# Altium project sara-n210_breakout.PrjPcb
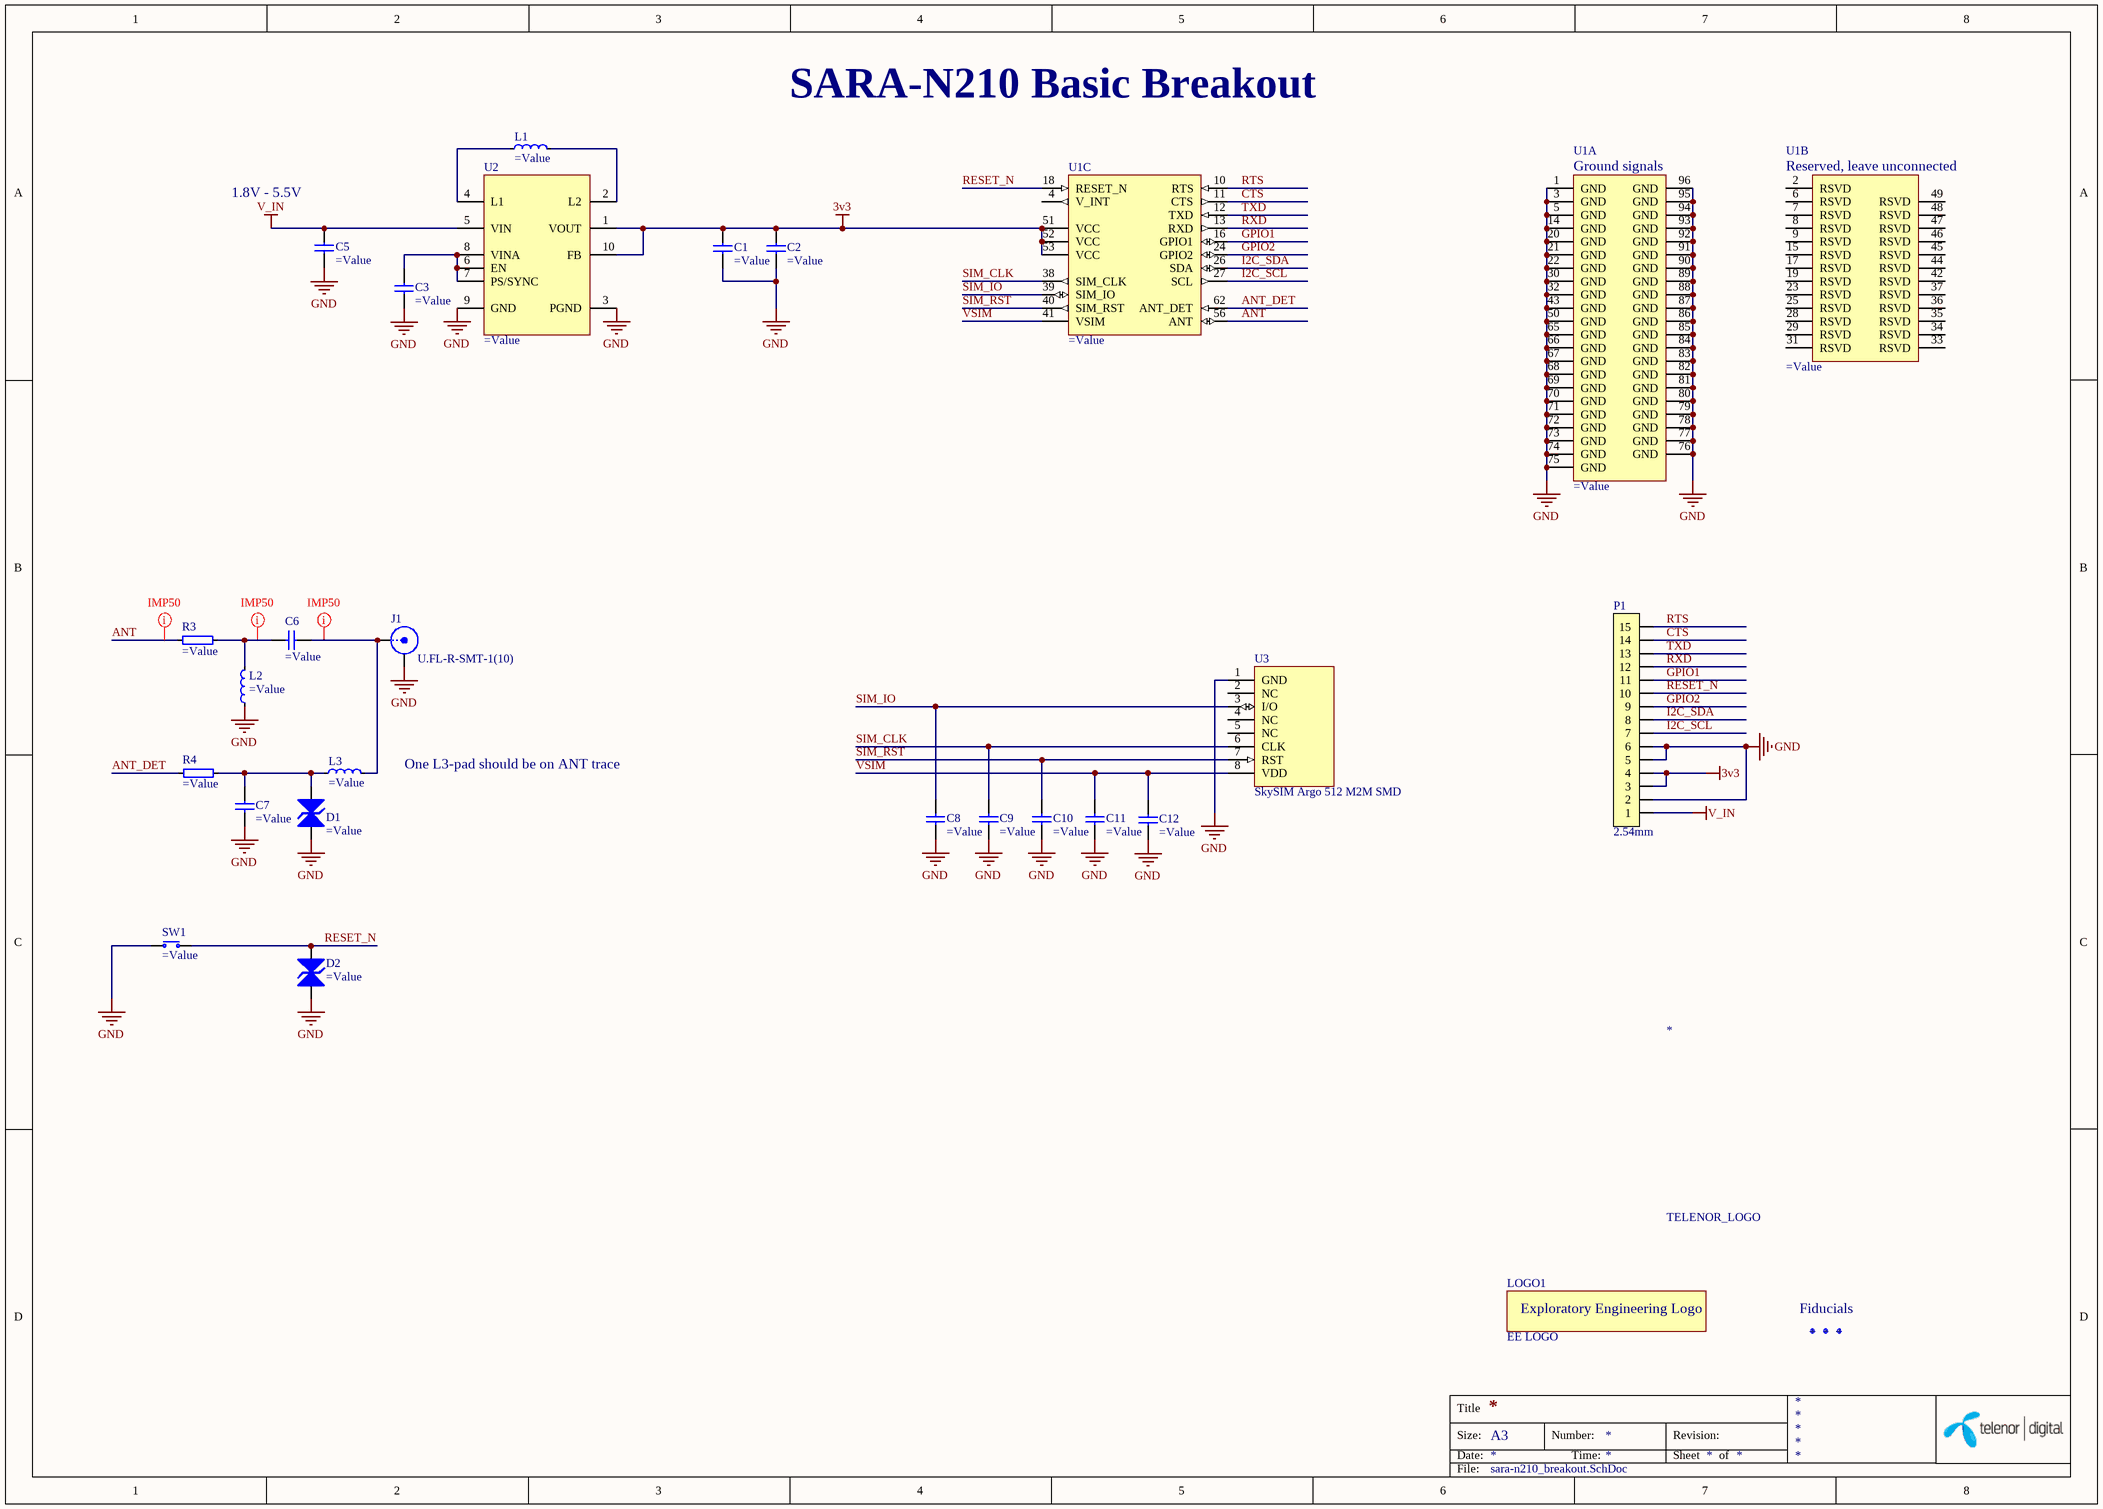
[diagram p0: sara-n210_breakout.SchDoc]
1 sheet, 29 parts. Net scope: global (net labels, ports and power ports of the same name join across sheets).
Board files: sara-n210_breakout.PcbDoc, panelized_sara-n210.PcbDoc

## Sheet sara-n210_breakout.SchDoc
size A3

### Parts
*  TELENOR_LOGO  [TELENOR_4mmx3.8mm]
C1  (no value)  [CAPC1005X04L]
C2  (no value)  [CAPC1005X04L]
C3  (no value)  [CAPC1005X04L]
C5  (no value)  [CAPC1005X04L]
C6  (no value)  [CAPC1005X04L]
C7  (no value)  [CAPC1005X04L]
C8  (no value)  [CAPC1005X04L]
C9  (no value)  [CAPC1005X04L]
C10  (no value)  [CAPC1005X04L]
C11  (no value)  [CAPC1005X04L]
C12  (no value)  [CAPC1005X04L]
D1  (no value)  [RESC1005X04L]
D2  (no value)  [RESC1005X04L]
Fid1  Fiducial mark  [Fiducial]  (value not drawn)
Fid2  Fiducial mark  [Fiducial]  (value not drawn)
Fid3  Fiducial mark  [Fiducial]  (value not drawn)
J1  U.FL-R-SMT-1(10)  [COAXIAL-UFL]
L1  (no value)  [INDP3030X11L]
L2  (no value)  [INDC1005X04L]
L3  (no value)  [INDC1005X04L]
LOGO1  EE LOGO  [EE_LOGO]
P1  2.54mm  [HDR_1x15_2.54mm_THRU]
R3  (no value)  [RESC1005X04L]
R4  (no value)  [RESC1005X04L]
SW1  (no value)  [RS-014R05B1-SMA10]
U1  (no value)  [UB-SARA-N2]  (parts A,B,C of 3)
U2  (no value)  [SON50P250X80_HS-11N]
U3  SkySIM Argo 512 M2M SMD  [QFN127P500X600X90_HS-9N]

### Nets
3v3: C1.2 C2.2 P1.3 P1.4 U1.51(VCC) U1.52(VCC) U1.53(VCC) U2.1(VOUT) U2.10(FB)
GND: C1.1 C2.1 C3.1 C5.1 C7.2 C8.1 C9.1 C10.1 C11.1 C12.1 D1.2(K) D2.2(K) J1.2(GND) L2.1 P1.2 P1.5 P1.6 SW1.2(COM) U1.1(GND) U1.3(GND) U1.5(GND) U1.14(GND) U1.20(GND) U1.21(GND) U1.22(GND) U1.30(GND) U1.32(GND) U1.43(GND) U1.50(GND) U1.65(GND) U1.66(GND) U1.67(GND) U1.68(GND) U1.69(GND) U1.70(GND) U1.71(GND) U1.72(GND) U1.73(GND) U1.74(GND) U1.75(GND) U1.76(GND) U1.77(GND) U1.78(GND) U1.79(GND) U1.80(GND) U1.81(GND) U1.82(GND) U1.83(GND) U1.84(GND) U1.85(GND) U1.86(GND) U1.87(GND) U1.88(GND) U1.89(GND) U1.90(GND) U1.91(GND) U1.92(GND) U1.93(GND) U1.94(GND) U1.95(GND) U1.96(GND) U2.3(PGND) U2.9(GND) U3.1(GND)
V_IN: C5.2 P1.1 U2.5(VIN)
ANT: R3.1 U1.56(ANT)
ANT_DET: R4.1 U1.62(ANT_DET)
CTS: P1.14 U1.11(CTS)
GPIO1: P1.11 U1.16(GPIO1)
GPIO2: P1.9 U1.24(GPIO2)
I2C_SCL: P1.7 U1.27(SCL)
I2C_SDA: P1.8 U1.26(SDA)
RESET_N: D2.1(A) P1.10 SW1.1(N.O) U1.18(RESET_N)
RTS: P1.15 U1.10(RTS)
RXD: P1.12 U1.13(RXD)
SIM_CLK: C9.2 U1.38(SIM_CLK) U3.6(CLK)
SIM_IO: C8.2 U1.39(SIM_IO) U3.3(I/O)
SIM_RST: C10.2 U1.40(SIM_RST) U3.7(RST)
TXD: P1.13 U1.12(TXD)
VSIM: C11.2 C12.2 U1.41(VSIM) U3.8(VDD)
NetC3_2: C3.2 U2.6(EN) U2.7(PS/SYNC) U2.8(VINA)
NetC6_1: C6.1 L2.2 R3.2
NetC6_2: C6.2 J1.1(Signal) L3.2
NetC7_1: C7.1 D1.1(A) L3.1 R4.2
NetL1_1: L1.1 U2.4(L1)
NetL1_2: L1.2 U2.2(L2)

Not connected (* = marked no-connect by the designer): U1 2(RSVD) 4(V_INT) 6(RSVD) 7(RSVD) 8(RSVD) 9(RSVD) 15(RSVD) 17(RSVD) 19(RSVD) 23(RSVD) 25(RSVD) 28(RSVD) 29(RSVD) 31(RSVD) 33(RSVD) 34(RSVD) 35(RSVD) 36(RSVD) 37(RSVD) 42(RSVD) 44(RSVD) 45(RSVD) 46(RSVD) 47(RSVD) 48(RSVD) 49(RSVD); U3 2(NC) 4(NC) 5(NC)

### Layout directives
net class IMP50: ANT, NetC6_1, NetC6_2

### Notes on the sheet
- SARA-N210 Basic Breakout
- (near C5) 1.8V - 5.5V
- (near L3) One L3-pad should be on ANT trace
- Fiducials
- Title
- Size:
- Date:
- A3
- Number:
- Time:
- Revision:
- Sheet
- of
- File:
- (in symbol EE-LOGO) Exploratory Engineering Logo
- (in symbol SARA-N2, part A) Ground signals
- (in symbol SARA-N2, part B) Reserved, leave unconnected

### Library data of the parts
C1 C2 C5 = GRM155R60J106ME15D: CAP CER 10UF 6.3V X5R 0402; Manufacturer: Murata Electronics North America; Capacitance: 10µF; Tolerance: ±20%; Value: 10µF; Supplier 1: Digi-Key; Manufacturer Part Number: GRM155R60J106ME15D; RoHS: RoHS Compliant; Category: Capacitors; Stock 1: 46293; Pricing 1: 1=0.23, 10=0.159, 50=0.0966, 100=0.0811, 250=0.06564, 500=0.0579, 1000=0.04922, 5000=0.0415 (USD); Packaging: Digi-Reel®; Part Status: Active; Voltage - Rated: 6.3V; Temperature Coefficient: X5R; Operating Temperature: -55°C ~ 85°C; Features: Derating Recommended; Ratings: -; Applications: General Purpose; Failure Rate: *; Mounting Type: Surface Mount, MLCC; Package / Case: 0402 (1005 Metric); Size / Dimension: 0.039" L x 0.020" W (1.00mm x 0.50mm); Height - Seated (Max): -; Thickness (Max): 0.026" (0.65mm); Lead Spacing: -; Lead Style: -; ComponentLink1URL: http://psearch.en.murata.com/capacitor/product/GRM155R60J106ME15#.pdf; ComponentLink1Description: http://psearch.en.murata.com/capacitor/product/GRM155R60J106ME15#.pdf; Supplier Part Number 1: 490-13238-6-ND
C3 C12 = GRM155R71C104KA88D: CAP CER 100nF 16V X7R 0402; Manufacturer: Murata Electronics North America; Tolerance: ±10%; Supplier 1: Digi-Key; Manufacturer Part Number: GRM155R71C104KA88D; RoHS: RoHS Compliant; Category: Capacitors; Stock 1: 24649903; Pricing 1: 1=0.16, 10=0.023, 50=0.0126, 100=0.0107, 250=0.00872, 500=0.00746, 1000=0.00581, 5000=0.00485 (EUR); Packaging: Digi-Reel®; Capacitance: 100nF; Voltage - Rated: 16V; Temperature Coefficient: X7R; Mounting Type: Surface Mount, MLCC; Operating Temperature: -55°C ~ 125°C; Applications: General Purpose; Ratings: -; Package / Case: 0402 (1005 Metric); Size / Dimension: 0.039" L x 0.020" W (1.00mm x 0.50mm); Height - Seated (Max): -; Thickness (Max): 0.022" (0.55mm); Lead Spacing: -; Features: -; Lead Style: -; ComponentLink1URL: http://www.murata.com/~/media/webrenewal/support/library/catalog/products/capacitor/mlcc/c02e.pdf; ComponentLink1Description: http://www.murata.com/~/media/webrenewal/support/library/catalog/products/capacitor/mlcc/c02e.pdf; Supplier Part Number 1: 490-3261-6-ND; Value: 100nF
C6 = GRM1555C1H330JZ01D: CAP CER 33PF 50V NP0 0402; Manufacturer: Murata Electronics North America; Tolerance: ±5%; Temperature Coefficient: C0G, NP0; Supplier 1: Digi-Key; Manufacturer Part Number: GRM1555C1H330JZ01D; RoHS: RoHS Compliant; Category: Capacitors; Stock 1: 0; Pricing 1: 1=0 (EUR); Packaging: Digi-Reel®; Capacitance: 33pF; Voltage - Rated: 50V; Mounting Type: Surface Mount, MLCC; Operating Temperature: -55°C ~ 125°C; Applications: General Purpose; Ratings: -; Package / Case: 0402 (1005 Metric); Size / Dimension: 0.039" L x 0.020" W (1.00mm x 0.50mm); Height - Seated (Max): -; Thickness (Max): 0.022" (0.55mm); Lead Spacing: -; Features: -; Lead Style: -; ComponentLink1URL: http://media.digikey.com/pdf/Data%20Sheets/Murata%20PDFs/Chip%20Monolithic%20Ceramic%20Caps.pdf; ComponentLink1Description: http://media.digikey.com/pdf/Data%20Sheets/Murata%20PDFs/Chip%20Monolithic%20Ceramic%20Caps.pdf; Supplier Part Number 1: 490-3220-6-ND; Value: 33pF
C7 = GRM1555C1H270JA01D: CAP CER 27PF 50V C0G/NP0 0402; Manufacturer: Murata Electronics North America; Tolerance: ±5%; Temperature Coefficient: C0G, NP0; Notification: Current market demand for these product types have resulted in fluctuating and extending lead times. Lead times may differ.; Supplier 1: Digi-Key; Manufacturer Part Number: GRM1555C1H270JA01D; RoHS: RoHS Compliant; Category: Capacitors; Stock 1: 408258; Pricing 1: 1=0.1, 10=0.019, 100=0.0087, 500=0.0062, 1000=0.00487, 2500=0.00443, 5000=0.00407 (USD); Packaging: Cut Tape (CT); Part Status: Active; Voltage - Rated: 50V; Operating Temperature: -55°C ~ 125°C; Features: -; Ratings: -; Applications: General Purpose; Mounting Type: Surface Mount, MLCC; Package / Case: 0402 (1005 Metric); Size / Dimension: 0.039" L x 0.020" W (1.00mm x 0.50mm); Height - Seated (Max): -; Thickness (Max): 0.022" (0.55mm); Lead Spacing: -; Lead Style: -; ComponentLink1URL: https://www.murata.com/~/media/webrenewal/support/library/catalog/products/capacitor/mlcc/c02e.ashx?la=en-us; ComponentLink1Description: https://www.murata.com/~/media/webrenewal/support/library/catalog/products/capacitor/mlcc/c02e.ashx?la=en-us; Supplier Part Number 1: 490-5869-1-ND; Value: 27pF; Capacitance: 27pF
C8-C11 = GRM1555C1H470JA01D: CAP CER 47PF 50V C0G/NP0 0402; Manufacturer: Murata Electronics North America; Tolerance: ±5%; Temperature Coefficient: C0G, NP0; Notification: Current market demand for these product types have resulted in fluctuating and extending lead times. Lead times may differ.; Supplier 1: Digi-Key; Manufacturer Part Number: GRM1555C1H470JA01D; RoHS: RoHS Compliant; Category: Capacitors; Stock 1: 0; Pricing 1: 1=0.1, 10=0.014, 100=0.0062, 500=0.00442, 1000=0.00348, 2500=0.00316, 5000=0.00291 (USD); Packaging: Cut Tape (CT); Part Status: Active; Voltage - Rated: 50V; Operating Temperature: -55°C ~ 125°C; Features: -; Ratings: -; Applications: General Purpose; Mounting Type: Surface Mount, MLCC; Package / Case: 0402 (1005 Metric); Size / Dimension: 0.039" L x 0.020" W (1.00mm x 0.50mm); Height - Seated (Max): -; Thickness (Max): 0.022" (0.55mm); Lead Spacing: -; Lead Style: -; ComponentLink1URL: https://www.murata.com/~/media/webrenewal/support/library/catalog/products/capacitor/mlcc/c02e.ashx?la=en-us; ComponentLink1Description: https://www.murata.com/~/media/webrenewal/support/library/catalog/products/capacitor/mlcc/c02e.ashx?la=en-us; Supplier Part Number 1: 490-5942-1-ND; Capacitance: 47pF; Value: 47pF
D1 = PESD0402-140: TVS DIODE 14VWM 40VC 0402; Manufacturer: Littelfuse Inc.; Type: Zener; Voltage - Reverse Standoff (Typ): 14V (Max); Voltage - Clamping (Max) @ Ipp: 40V; Power Line Protection: No; Supplier 1: Digi-Key; Manufacturer Part Number: PESD0402-140; RoHS: RoHS Compliant; Category: Circuit Protection; Stock 1: 178325; Pricing 1: 1=0.61, 10=0.476, 25=0.4008, 100=0.3263, 250=0.2704, 500=0.22378, 1000=0.16783, 2500=0.15385, 5000=0.14452 (USD); Packaging: Cut Tape (CT); Part Status: Active; Voltage - Breakdown (Min): -; Current - Peak Pulse (10/1000µs): -; Power - Peak Pulse: -; Applications: Ethernet, HDMI; Capacitance @ Frequency: -; Operating Temperature: -55°C ~ 125°C (TJ); Mounting Type: Surface Mount; Package / Case: 0402 (1005 Metric); Supplier Device Package: 0402; ComponentLink1URL: http://www.littelfuse.com/~/media/electronics/product_specifications/polymer_esd_suppressors/littelfuse_polymer_esd_suppressor_pesd0402_140_product_specification.pdf.pdf; ComponentLink1Description: http://www.littelfuse.com/~/media/electronics/product_specifications/polymer_esd_suppressors/littelfuse_polymer_esd_suppressor_pesd0402_140_product_specification.pdf.pdf; Supplier Part Number 1: PESD0402-140CT-ND; Value: PESD0402-140
D2 = B72590T8140S160: VARISTOR 28V 2A 0402; Manufacturer: EPCOS (TDK); Energy: 0.03J; Capacitance @ Frequency: 10pF @ 1MHz; Supplier 1: Digi-Key; Manufacturer Part Number: B72590T8140S160; RoHS: RoHS Compliant; Category: Circuit Protection; Stock 1: 18512; Pricing 1: 1=0.43, 10=0.302, 25=0.2476, 100=0.198, 250=0.14404, 500=0.11702, 1000=0.09002, 2500=0.08102, 5000=0.07652 (USD); Packaging: Cut Tape (CT); Part Status: Active; Operating Temperature: -55°C ~ 125°C (TA); Mounting Type: Surface Mount, MLCV; Package / Case: 0402 (1005 Metric); ComponentLink1URL: https://en.tdk.eu/inf/75/db/CTVS_14/Standard_series.pdf; ComponentLink1Description: https://en.tdk.eu/inf/75/db/CTVS_14/Standard_series.pdf; Supplier Part Number 1: 495-3426-1-ND; Value: B72590T8140S160
Fid1-Fid3 = Fiducial: Part Number: Fid-Mark; Artikkelnr Noca: N.A.; Manufacturer: *; Manufacturer Part Number: *; Datasheet: *; LatestRevisionDate: 2009-12-12; Pin Count: 1; Publisher: Nordic Semiconductor; Published: 2009-12-12; Value: *; Note: *; Supplier: *; Supplier part number: *; 2nd source Supplier: *; 2nd source part number: *; Footprint Doc: Fiducial; Artikkelnr Simpro: N.A.
J1 = U.FL-R-SMT-1(10): CONN UMC JACK STR 50 OHM SMD; Manufacturer: Hirose Electric Co Ltd; Connector Style: U.FL; Connector Type: Jack, Male Pin; Contact Termination: Solder; Impedance: 50 Ohm; Frequency - Max: 6GHz; Body Material: Phosphor Bronze; Body Finish: Silver; Center Contact Plating: Gold; Dielectric Material: Liquid Crystal Polymer (LCP); Supplier 1: Digi-Key; Manufacturer Part Number: U.FL-R-SMT-1(10); RoHS: RoHS Compliant; Category: Connectors, Interconnects; Stock 1: 124618; Pricing 1: 1=1.15, 10=1.013, 25=0.9532, 50=0.9138, 100=0.8739, 250=0.79448, 500=0.71504, 1000=0.63559 (EUR); Packaging: Digi-Reel®; Shield Termination: Solder; Mounting Type: Surface Mount; Cable Group: -; Fastening Type: Snap-On; Features: -; Housing Color: Silver; Ingress Protection: -; Center Contact Material: Phosphor Bronze; Voltage Rating: -; Operating Temperature: -40°C ~ 90°C; ComponentLink1URL: http://media.digikey.com/pdf/Data%20Sheets/Hirose%20PDFs/UFL%20Series.pdf; ComponentLink1Description: http://media.digikey.com/pdf/Data%20Sheets/Hirose%20PDFs/UFL%20Series.pdf; Supplier Part Number 1: H11891DKR-ND
L1 = LQH3NPZ1R5MGRL: FIXED IND 1.5UH 2.04A 88.8 MOHM; Manufacturer: Murata Electronics North America; Type: Wirewound; Material - Core: Ferrite; Tolerance: ±20%; Shielding: Shielded; DC Resistance (DCR): 88.8 mOhm Max; Value: 1.5µF; Supplier 1: Digi-Key; Manufacturer Part Number: LQH3NPZ1R5MGRL; RoHS: RoHS Compliant; Category: Inductors, Coils, Chokes; Stock 1: 5493; Pricing 1: 1=0.44, 10=0.382, 100=0.2731, 500=0.22942, 1000=0.18573 (USD); Packaging: Digi-Reel®; Part Status: Active; Ratings: AEC-Q200; Operating Temperature: -40°C ~ 85°C; Mounting Type: Surface Mount; Package / Case: 1212 (3030 Metric); Supplier Device Package: 1212 (3030 Metric); Size / Dimension: 0.118" L x 0.118" W (3.00mm x 3.00mm); Height - Seated (Max): 0.039" (1.00mm); ComponentLink1URL: http://search.murata.co.jp/Ceramy/image/img/P02/JELF243A-9130.pdf; ComponentLink1Description: http://search.murata.co.jp/Ceramy/image/img/P02/JELF243A-9130.pdf; Supplier 2: Digi-Key; Supplier 3: Digi-Key; Supplier Part Number 1: 490-15959-6-ND; Supplier Part Number 2: 490-15959-1-ND; Supplier Part Number 3: 490-15959-2-ND; Inductance: 1.5µF
L2 = LQG15HN39NJ02D: FIXED IND 39NH 250MA 1.06 OHM; Manufacturer: Murata Electronics North America; Type: Multilayer; Tolerance: ±5%; Shielding: Unshielded; DC Resistance (DCR): 1.06 Ohm Max; Q @ Freq: 8 @ 100MHz; Supplier 1: Digi-Key; Manufacturer Part Number: LQG15HN39NJ02D; RoHS: RoHS Compliant; Category: Inductors, Coils, Chokes; Stock 1: 10603; Pricing 1: 1=0.1, 10=0.066, 100=0.0442, 500=0.0368, 1000=0.03091, 2500=0.0265 (USD); Packaging: Cut Tape (CT); Part Status: Active; Material - Core: -; Ratings: -; Operating Temperature: -55°C ~ 125°C; Mounting Type: Surface Mount; Package / Case: 0402 (1005 Metric); Supplier Device Package: 0402 (1005 Metric); Size / Dimension: 0.039" L x 0.020" W (1.00mm x 0.50mm); Height - Seated (Max): 0.022" (0.55mm); ComponentLink1URL: http://search.murata.co.jp/Ceramy/image/img/P02/JELF243B-0009.pdf; ComponentLink1Description: http://search.murata.co.jp/Ceramy/image/img/P02/JELF243B-0009.pdf; Supplier Part Number 1: 490-1092-1-ND; Value: 39nH; Inductance: 39nH
L3 = LQG15HS82NJ02D: FIXED IND 82NH 150MA 1.2 OHM SMD; Manufacturer: Murata Electronics North America; Type: Multilayer; Material - Core: Air; Tolerance: ±5%; Shielding: Unshielded; DC Resistance (DCR): 1.2 Ohm Max; Q @ Freq: 8 @ 100MHz; Frequency - Self Resonant: 700MHz; Frequency - Test: 100MHz; Supplier 1: Digi-Key; Manufacturer Part Number: LQG15HS82NJ02D; RoHS: RoHS Compliant; Category: Inductors, Coils, Chokes; Stock 1: 28103; Pricing 1: 1=0.09, 10=0.061, 25=0.0548, 50=0.0474, 100=0.0425, 250=0.03948, 500=0.03646, 750=0.03464, 1000=0.0316 (EUR); Packaging: Digi-Reel®; Inductance: 82nH; Current Rating: 150mA; Current - Saturation: -; Ratings: -; Operating Temperature: -55°C ~ 125°C; Mounting Type: Surface Mount; Package / Case: 0402 (1005 Metric); Size / Dimension: 0.039" L x 0.020" W (1.00mm x 0.50mm); Height - Seated (Max): 0.022" (0.55mm); ComponentLink1URL: http://search.murata.co.jp/Ceramy/image/img/PDF/ENG/L0075S0083LQG15HS.pdf; ComponentLink1Description: http://search.murata.co.jp/Ceramy/image/img/PDF/ENG/L0075S0083LQG15HS.pdf; Supplier Part Number 1: 490-2634-6-ND; Value: 82nH
LOGO1 = EE-LOGO: Exploratory Engineering Logo Silkscreen
P1 = HDR_1x15_2.54MM_MALE: Header, 1x15, Pitch 2.54mm, Male; Pitch: 2.54mm; Pins: 15
R3 = RC0402JR-070RL: RES SMD 0.0OHM JUMPER 1/16W 0402; Manufacturer: Yageo; Resistance (Ohms): 0.0; Power (Watts): 0.063W, 1/16W; Value: 0.0; Supplier 1: Digi-Key; Manufacturer Part Number: RC0402JR-070RL; RoHS: RoHS Compliant; Category: Resistors; Stock 1: 10063535; Pricing 1: 1=0.1, 10=0.013, 25=0.0092, 100=0.0053, 250=0.004, 500=0.0032, 1000=0.00236, 2500=0.00205, 5000=0.00169 (USD); Packaging: Digi-Reel®; Tolerance: Jumper; Composition: Thick Film; Features: Moisture Resistant; Temperature Coefficient: -; Operating Temperature: -55°C ~ 155°C; Package / Case: 0402 (1005 Metric); Supplier Device Package: 0402; Size / Dimension: 0.039" L x 0.020" W (1.00mm x 0.50mm); Height: 0.016" (0.40mm); Number of Terminations: 2; ComponentLink1URL: http://www.yageo.com/NewPortal/yageodocoutput?fileName=/pdf/R-Chip/PYu-RC_Group_51_RoHS_L_3.pdf; ComponentLink1Description: http://www.yageo.com/NewPortal/yageodocoutput?fileName=/pdf/R-Chip/PYu-RC_Group_51_RoHS_L_3.pdf; Supplier Part Number 1: 311-0.0JRDKR-ND
R4 = MCS04020C1002FE000: RES SMD 10K OHM 1% 1/10W 0402; Manufacturer: Vishay Beyschlag; Power (Watts): 0.1W, 1/10W; Temperature Coefficient: ±50ppm/°C; Supplier 1: Digi-Key; Manufacturer Part Number: MCS04020C1002FE000; RoHS: RoHS Compliant; Category: Resistors; Stock 1: 18685; Pricing 1: 1=0.3, 10=0.254, 100=0.0993, 1000=0.04158, 2500=0.03812, 5000=0.03465 (USD); Packaging: Cut Tape (CT); Part Status: Active; Tolerance: ±1%; Composition: Thin Film; Features: -; Operating Temperature: -55°C ~ 155°C; Package / Case: 0402 (1005 Metric); Supplier Device Package: 0402; Size / Dimension: 0.039" L x 0.020" W (1.00mm x 0.50mm); Height - Seated (Max): 0.015" (0.37mm); Failure Rate: -; ComponentLink1URL: http://www.vishay.com/docs/28705/mcx0x0xpro.pdf; ComponentLink1Description: http://www.vishay.com/docs/28705/mcx0x0xpro.pdf; Supplier Part Number 1: MCS0402-10.0K-CFCT-ND; Value: 10k; Resistance: 10k
SW1 = RS-014R05B1-SMA10 RT: SWITCH TACTILE SPST-NO 0.05A 12V; Manufacturer: C&K; Switch Function: Off-Mom; Contact Rating @ Voltage: 0.05A @ 12VDC; Actuator Type: Standard; Actuator Height off PCB, Vertical: 5.00mm; Actuator Orientation: Top Actuated; Outline: 6.00mm x 6.00mm; Illumination: Non-Illuminated; Operating Force: 160gf; Actuator Material: Polyamide (PA), Nylon; Switch Travel: 0.25mm; Mechanical Life: 100,000 Cycles; Supplier 1: Digi-Key; Manufacturer Part Number: RS-014R05B1-SMA10 RT; RoHS: RoHS Compliant; Category: Switches; Stock 1: 35708; Pricing 1: 1=0.36, 10=0.348, 25=0.3356, 50=0.3232, 100=0.3108, 250=0.28588, 500=0.2486 (USD); Packaging: Digi-Reel®; Part Status: Active; Circuit: SPST-NO; Mounting Type: Surface Mount; Actuator Length, Right Angle: -; Termination Style: Gull Wing; Illumination Type, Color: -; Illumination Voltage (Nominal): -; Ingress Protection: -; Features: -; Operating Temperature: -; ComponentLink1URL: http://media.digikey.com/pdf/Data%20Sheets/C&K/RS-014R05__-SMA%20_RT.pdf; ComponentLink1Description: http://media.digikey.com/pdf/Data%20Sheets/C&K/RS-014R05__-SMA%20_RT.pdf; Supplier Part Number 1: CKN10392DKR-ND; Value: RS-014R05B1-SMA10 RT
U1 = SARA-N2: uBlox Sara N210; Manufacturer Part Number: SARA-N210-02B; Value: SARA-N210-02B
U2 = TPS63031DSKR: IC REG BUCK BST 3.3V 0.9A 10SON; Manufacturer: Texas Instruments; Function: Step-Up/Step-Down; Output Configuration: Positive; Topology: Buck-Boost; Output Type: Fixed; Number of Outputs: 1; Voltage - Input (Min): 1.8V; Voltage - Input (Max): 5.5V; Current - Output: 900mA (Switch); Frequency - Switching: 2.4MHz; Synchronous Rectifier: Yes; Supplier 1: Digi-Key; Manufacturer Part Number: TPS63031DSKR; RoHS: RoHS Compliant; Category: Integrated Circuits (ICs); Stock 1: 14803; Pricing 1: 1=1.93, 10=1.731, 100=1.3909, 500=1.14278, 1000=0.94688 (USD); Packaging: Digi-Reel®; Part Status: Active; Voltage - Output (Min/Fixed): 3.3V; Voltage - Output (Max): -; Operating Temperature: -40°C ~ 85°C (TA); Mounting Type: Surface Mount; Package / Case: 10-WFDFN Exposed Pad; Supplier Device Package: 10-SON (2.5x2.5); ComponentLink1URL: http://www.ti.com/lit/ds/symlink/tps63030.pdf; ComponentLink1Description: http://www.ti.com/lit/ds/symlink/tps63030.pdf; Supplier 2: Digi-Key; Supplier 3: Digi-Key; Supplier Part Number 1: 296-39461-6-ND; Supplier Part Number 2: 296-39461-1-ND; Supplier Part Number 3: 296-39461-2-ND; Value: TPS63031DSKR
U3 = SKYSIM-ARGO-LTE-MFF2: SkySIM® Argo 512 M2M SMD - LTE; Value: SkySIM Argo 512 M2M SMD